# Altium schematic sheet BMS.SchDoc
size A4
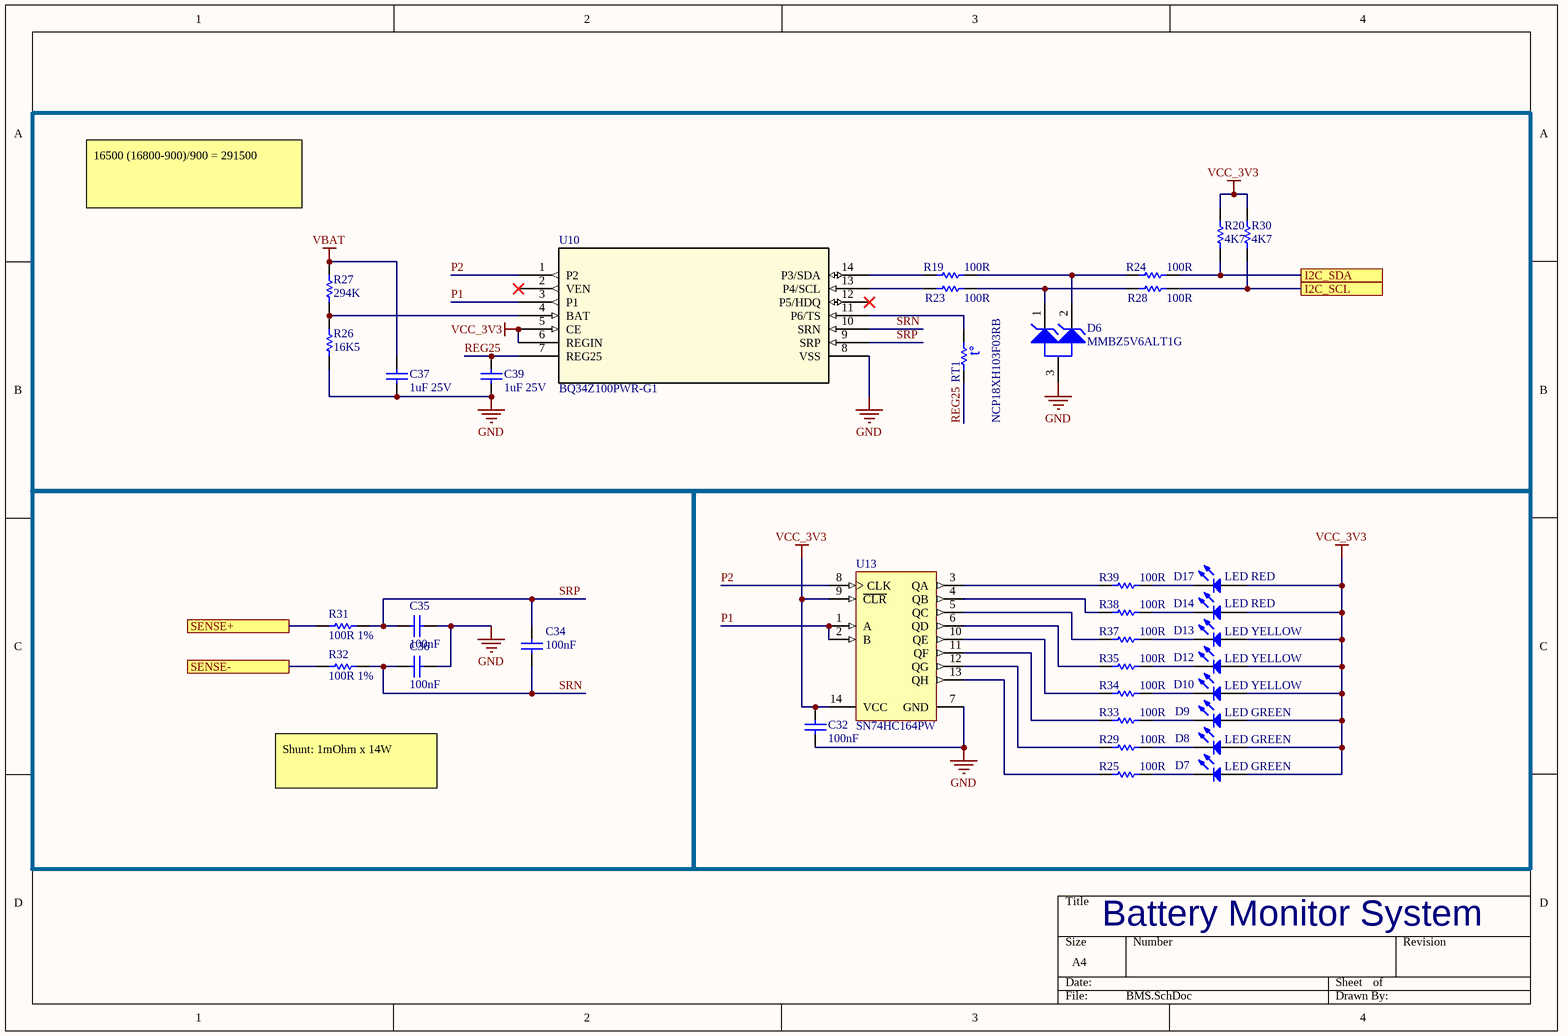
[diagram p0: BMS.SchDoc]

## Parts
C32  100nF  [CAPC0603(1608)100_L]
C34  100nF  [CAPC0603(1608)100_L]
C35  100nF  [CAPC0603(1608)100_L]
C36  100nF  [CAPC0603(1608)100_L]
C37  1uF 25V  [CAPC0603(1608)100_L]
C39  1uF 25V  [CAPC0603(1608)100_L]
D6  MMBZ5V6ALT1G  [ONSC-SOT-23-3-318-08_V]
D7  LED GREEN  [LED_0805]
D8  LED GREEN  [LED_0805]
D9  LED GREEN  [LED_0805]
D10  LED YELLOW  [LED_0805]
D12  LED YELLOW  [LED_0805]
D13  LED YELLOW  [LED_0805]
D14  LED RED  [LED_0805]
D17  LED RED  [LED_0805]
R19  100R  [RESC0603(1608)_L]
R20  4K7  [RESC0603(1608)_L]
R23  100R  [RESC0603(1608)_L]
R24  100R  [RESC0603(1608)_L]
R25  100R  [RESC0603(1608)_L]
R26  16K5  [RESC0603(1608)_L]
R27  294K  [RESC0603(1608)_L]
R28  100R  [RESC0603(1608)_L]
R29  100R  [RESC0603(1608)_L]
R30  4K7  [RESC0603(1608)_L]
R31  100R 1%  [RESC0603(1608)_L]
R32  100R 1%  [RESC0603(1608)_L]
R33  100R  [RESC0603(1608)_L]
R34  100R  [RESC0603(1608)_L]
R35  100R  [RESC0603(1608)_L]
R37  100R  [RESC0603(1608)_L]
R38  100R  [RESC0603(1608)_L]
R39  100R  [RESC0603(1608)_L]
RT1  NCP18XH103F03RB  [MURA-NCP18XH103F03RB-2_V]
U10  BQ34Z100PWR-G1  [PW14]
U13  SN74HC164PW  [PW0014A_N]

## Ports
I2C_SCL, I2C_SDA, SENSE+, SENSE-

## Nets
GND: C32.1 C35.1 C36.1 C37.1 C39.1 D6.3(A) R26.1 U10.8(VSS) U13.7(GND)
VBAT: C37.2 R27.2
VCC_3V3: C32.2 D7.2(A) D8.2(A) D9.2(A) D10.2(A) D12.2(A) D13.2(A) D14.2(A) D17.2(A) R20.2 R30.2 U10.5(CE) U10.6(REGIN) U13.9(~{CLR}) U13.14(VCC)
I2C_SCL: R28.2 R30.1 ; port I2C_SCL
I2C_SDA: R20.1 R24.2 ; port I2C_SDA
P1: U10.3(P1) U13.1(A) U13.2(B)
P2: U10.1(P2) U13.8(CLK)
REG25: C39.2 RT1.1 U10.7(REG25)
SENSE+: R31.1 ; port SENSE+
SENSE-: R32.1 ; port SENSE-
SRN: C34.1 C36.2 R32.2 U10.10(SRN)
SRP: C34.2 C35.2 R31.2 U10.9(SRP)
NetD6_1: D6.1(K1) R23.2 R28.1
NetD6_2: D6.2(K2) R19.2 R24.1
NetD7_1: D7.1(K) R25.2
NetD8_1: D8.1(K) R29.2
NetD9_1: D9.1(K) R33.2
NetD10_1: D10.1(K) R34.2
NetD12_1: D12.1(K) R35.2
NetD13_1: D13.1(K) R37.2
NetD14_1: D14.1(K) R38.2
NetD17_1: D17.1(K) R39.2
NetR19_1: R19.1 U10.14(P3/SDA)
NetR23_1: R23.1 U10.13(P4/SCL)
NetR25_1: R25.1 U13.13(QH)
NetR26_2: R26.2 R27.1 U10.4(BAT)
NetR29_1: R29.1 U13.12(QG)
NetR33_1: R33.1 U13.11(QF)
NetR34_1: R34.1 U13.10(QE)
NetR35_1: R35.1 U13.6(QD)
NetR37_1: R37.1 U13.5(QC)
NetR38_1: R38.1 U13.4(QB)
NetR39_1: R39.1 U13.3(QA)
NetRT1_2: RT1.2 U10.11(P6/TS)

Not connected (* = marked no-connect by the designer): U10 2(VEN)* 12(P5/HDQ)*

## Notes on the sheet
- 16500 (16800-900)/900 = 291500
- Shunt: 1mOhm x 14W
- Battery Monitor System
- (in symbol CMP-2000-05271-1) t°

## Library data of the parts
C32 C34-C36 = CMP-1035-02595-1: CAP 100nF 100V ±10% 0603 (1608 Metric) Thickness 1mm SMD; Tolerance: Â±10%; Case-EIA: 0603; Case-Metric: 1608; Rated Voltage: 100 V; Value: 100nF; Technology: SMT; Max Thickness: 1 mm
C37 C39 = CMP-1035-02740-1: CAP 1uF 25V ±10% 0603 (1608 Metric) Thickness 1mm SMD; Tolerance: Â±10%; Case-Metric: 1608; Case-EIA: 0603; Technology: SMT; Rated Voltage: 25 V; Max Thickness: 1 mm; Value: 1uF
D6 = CMP-1060-01222-1: 24 W Peak Power Zener Transient Voltage Suppressor, Dual Common Anode Zeners for ESD Protection, 3-Pin SOT-23, Pb-Free, Tape and Reel; Manufacturer: On Semiconductor; VZ Typ (V): 5.6; PackageVersion: Rev. AP, 11/2009; ComponentLink1URL: http://www.onsemi.com/; Packing: Tape and Reel; DatasheetVersion: Rev. 13; ComponentLink1Description: Manufacturer URL; ComponentLink3URL: http://www.onsemi.cn/pub_link/Collateral/318-08.PDF; ComponentLink2Description: Datasheet; PackageDescription: 3-Pin Small Outline Transistor, Body 2.92 x 1.3 mm, Pitch 0.95 mm; ComponentLink3Description: Package Specification; RoHS: Pb-Free; ComponentLink2URL: http://www.onsemi.cn/pub_link/Collateral/MMBZ5V6ALT1-D.PDF; PackageReference: SOT-23-3-318-08; Mounting Technology: Surface Mount; PartNumber: MMBZ5V6ALT1G
D7-D9 = LED0: led / LTST-C171KRKT; Manufacturer: Lite-On Inc.; Manufacturer Part Number: LTST-C171KGKT; Lens Color: Colorless; Lens Transparency: Clear; Millicandela Rating: 35mcd; Lens Style/Size: Rectangle with Flat Top, 1.40mm x 1.25mm; Voltage - Forward (Vf) (Typ): 2V; Current - Test: 20mA; Viewing Angle: 130°; Wavelength - Dominant: 571nm; Wavelength - Peak: 574nm; Supplier 1: Digi-Key; Supplier Part Number 1: 160-1426-1-ND; RoHS: RoHS Compliant; Category: Optoelectronics; Stock 1: 350441; Pricing 1: 1=0.31, 10=0.225, 25=0.1656, 100=0.1183, 250=0.0804, 500=0.07096, 1000=0.05558 (USD); Packaging: Cut Tape (CT); Part Status: Active; Color: Green; Mounting Type: Surface Mount; Features: -; Package / Case: 0805 (2012 Metric); Size / Dimension: 2.00mm L x 1.25mm W; Height (Max): 0.90mm; ComponentLink1URL: http://optoelectronics.liteon.com/upload/download/DS22-2000-118/LTST-C171KGKT.pdf; ComponentLink1Description: http://optoelectronics.liteon.com/upload/download/DS22-2000-118/LTST-C171KGKT.pdf
D10 D12 D13 = LED0: led / LTST-C171KSKT; Manufacturer: Lite-On Inc.; Color: Green; Lens Color: Colorless; Lens Transparency: Clear; Millicandela Rating: 35mcd; Lens Style/Size: Rectangle with Flat Top, 1.40mm x 1.25mm; Voltage - Forward (Vf) (Typ): 2V; Current - Test: 20mA; Viewing Angle: 130°; Wavelength - Dominant: 571nm; Wavelength - Peak: 574nm; Supplier 1: Digi-Key; Supplier Part Number 1: 160-1428-1-ND; Manufacturer Part Number: LTST-C171KSKT; RoHS: RoHS Compliant; Category: Optoelectronics; Stock 1: 350441; Pricing 1: 1=0.31, 10=0.225, 25=0.1656, 100=0.1183, 250=0.0804, 500=0.07096, 1000=0.05558 (USD); Packaging: Cut Tape (CT); Part Status: Active; Mounting Type: Surface Mount; Features: -; Package / Case: 0805 (2012 Metric); Size / Dimension: 2.00mm L x 1.25mm W; Height (Max): 0.90mm; ComponentLink1URL: http://optoelectronics.liteon.com/upload/download/DS22-2000-110/LTST-C171KSKT.pdf; ComponentLink1Description: http://optoelectronics.liteon.com/upload/download/DS22-2000-110/LTST-C171KSKT.pdf
D14 D17 = LED0: led / LTST-C171KRKT; Manufacturer: Lite-On Inc.; Lens Color: Colorless; Lens Transparency: Clear; Millicandela Rating: 54mcd; Lens Style/Size: Rectangle with Flat Top, 1.40mm x 1.25mm; Voltage - Forward (Vf) (Typ): 2V; Current - Test: 20mA; Viewing Angle: 130°; Wavelength - Dominant: 631nm; Wavelength - Peak: 639nm; Supplier 1: Digi-Key; Supplier Part Number 1: 160-1427-1-ND; Manufacturer Part Number: LTST-C171KRKT; RoHS: RoHS Compliant; Category: Optoelectronics; Stock 1: 260544; Pricing 1: 1=0.31, 10=0.225, 25=0.1656, 100=0.1183, 250=0.0804, 500=0.07096, 1000=0.05558 (USD); Packaging: Cut Tape (CT); Part Status: Active; Color: Red; Mounting Type: Surface Mount; Features: -; Package / Case: 0805 (2012 Metric); Size / Dimension: 2.00mm L x 1.25mm W; Height (Max): 0.80mm; ComponentLink1URL: http://optoelectronics.liteon.com/upload/download/DS22-2000-109/LTST-C171KRKT.pdf; ComponentLink1Description: http://optoelectronics.liteon.com/upload/download/DS22-2000-109/LTST-C171KRKT.pdf
R19 R23 R24 R28 R31 R32 = CMP-1012-00397-1: 100R 0.1W 1% 0603 (1608 Metric)  SMD; Value: 100.00 Ohm; Case-EIA: 0603; Case-Metric: 1608; Technology: SMT; Tolerance: 1 %; Power: 0.1 W
R20 R30 = CMP-1012-00586-1: 4K7 0.1W 1% 0603 (1608 Metric)  SMD; Case-EIA: 0603; Case-Metric: 1608; Value: 4700.00 Ohm; Power: 0.1 W; Tolerance: 1 %; Technology: SMT
R25 R29 R33-R35 R37-R39 = CMP-1012-00050-1: 100R 0.1W 5% 0603 (1608 Metric)  SMD; Case-EIA: 0603; Value: 100.00 Ohm; Case-Metric: 1608; Tolerance: 5 %; Technology: SMT; Power: 0.1 W
R26 = CMP-1012-00646-1: 16K5 0.1W 1% 0603 (1608 Metric)  SMD; Case-Metric: 1608; Value: 16500.00 Ohm; Case-EIA: 0603; Technology: SMT; Power: 0.1 W; Tolerance: 1 %
R27 = CMP-1012-00787-1: 294K 0.1W 1% 0603 (1608 Metric)  SMD; Case-Metric: 1608; Value: 294000.00 Ohm; Case-EIA: 0603; Power: 0.1 W; Tolerance: 1 %; Technology: SMT
RT1 = CMP-2000-05271-1: NTC Thermistor, 10 KOhm, +/- 1%, 0.1 W, -40 to 125 degC, 0603 (1608 Metric), RoHS, Tape and Reel; Manufacturer: Murata; B-constant: 3434K; Resistance: 10kO; Rated Current: 310A; Datasheet URL: http://www.jameco.com/Jameco/Products/ProdDS/1870999.pdf; Datasheet Version: Apr-05; Temperature Range: -40to+125degC; Tolerance (%): ±1%; Manufacturer URL: http://www.murata.com/; Type: NTC
U10 = BQ34Z100PWR-G1: No Description Available; Vendor: Texas Instruments; Built_By: EMA_UL_Team; Manufacturer_Part_Number: BQ34Z100PWR-G1; Copyright: Copyright (C) 2018 Accelerated Designs. All rights reserved; RefDes: RefDes; Type: DEV; Value: Value
U13 = CMP-0780-00173-3: 8-Bit Parallel-Out Serial Shift Registers, PW0014A, TUBE; Manufacturer: Texas Instruments; Output Drive (IOL/IOH)(Max)(mA): 5.2/-5.2; Technology Family: HC; 3-State Output: No; Voltage(Nom)(V): 6; ICC @ Nom Voltage(Max)(mA): 0.08; Rating: Catalog; F @ Nom Voltage(Max)(Mhz): 28; Output Type: CMOS; tpd @ Nom Voltage(Max)(ns): 38; VCC(Min)(V): 2; Bits: 4; DatasheetVersion: SCLS115F; VCC(Max)(V): 6; PackageReference: PW0014A; Input Type: CMOS; PackageVersion: http://www.ti.com/lit/ml/mpds360/mpds360.pdf; Operating Temperature Range(C): -40 to 125; Code_JEDEC: MO-153; Generic Part Number: SN74HC164